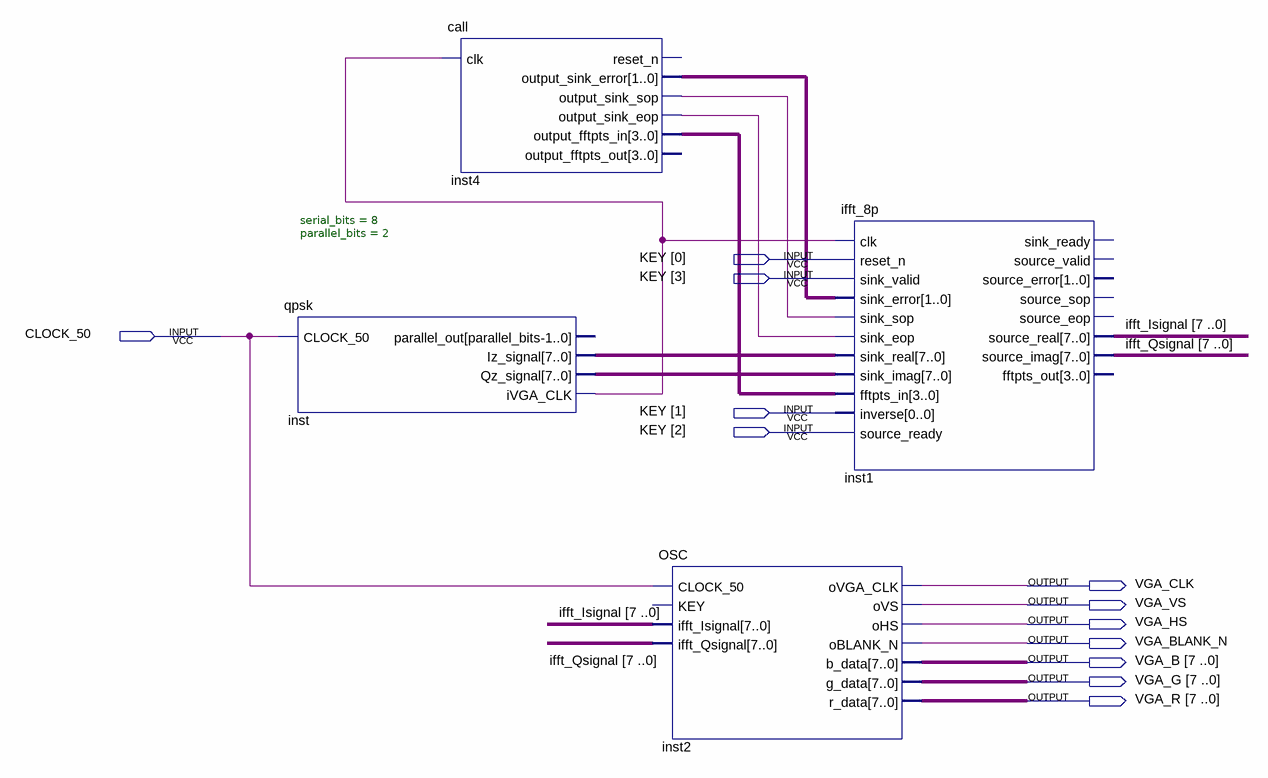
[diagram p0: schematic sheet]
// Quartus schematic ofdm_transmitter.bdf as structural Verilog: 4 symbols, 12 pins
module ofdm_transmitter (
  input  [3:0] KEY,
  input  CLOCK_50,
  output VGA_CLK,
  output VGA_VS,
  output VGA_HS,
  output VGA_BLANK_N,
  output [7:0] VGA_B,
  output [7:0] VGA_G,
  output [7:0] VGA_R
);

  wire inst4_output_sink_eop, inst4_output_sink_sop, inst_ivga_clk;
  wire [1:0] inst4_output_sink_error;
  wire [3:0] inst4_output_fftpts_in;
  wire [7:0] ifft_Isignal, ifft_Qsignal, inst_iz_signal, inst_qz_signal;

  qpsk #(.serial_bits(8), .parallel_bits(2)) inst (
    .CLOCK_50(CLOCK_50), .Iz_signal(inst_iz_signal), .Qz_signal(inst_qz_signal), .iVGA_CLK(inst_ivga_clk));  // open: parallel_out
  call inst4 (
    .clk(inst_ivga_clk), .output_sink_error(inst4_output_sink_error),
    .output_sink_sop(inst4_output_sink_sop), .output_sink_eop(inst4_output_sink_eop),
    .output_fftpts_in(inst4_output_fftpts_in));  // open: reset_n, output_fftpts_out
  OSC inst2 (
    .CLOCK_50(CLOCK_50), .ifft_Isignal(ifft_Isignal), .ifft_Qsignal(ifft_Qsignal), .oVGA_CLK(VGA_CLK),
    .oVS(VGA_VS), .oHS(VGA_HS), .oBLANK_N(VGA_BLANK_N), .b_data(VGA_B), .g_data(VGA_G), .r_data(VGA_R));  // open: KEY
  ifft_8p inst1 (
    .clk(inst_ivga_clk), .reset_n(KEY[0]), .sink_valid(KEY[3]), .sink_error(inst4_output_sink_error),
    .sink_sop(inst4_output_sink_sop), .sink_eop(inst4_output_sink_eop), .sink_real(inst_iz_signal),
    .sink_imag(inst_qz_signal), .fftpts_in(inst4_output_fftpts_in), .inverse(KEY[1]), .source_ready(KEY[2]),
    .source_real(ifft_Isignal), .source_imag(ifft_Qsignal));  // open: sink_ready, source_valid, source_error, source_sop, source_eop, fftpts_out
endmodule
